# Altium schematic sheet [08] - LoRa_RAK3172.SchDoc
size A4
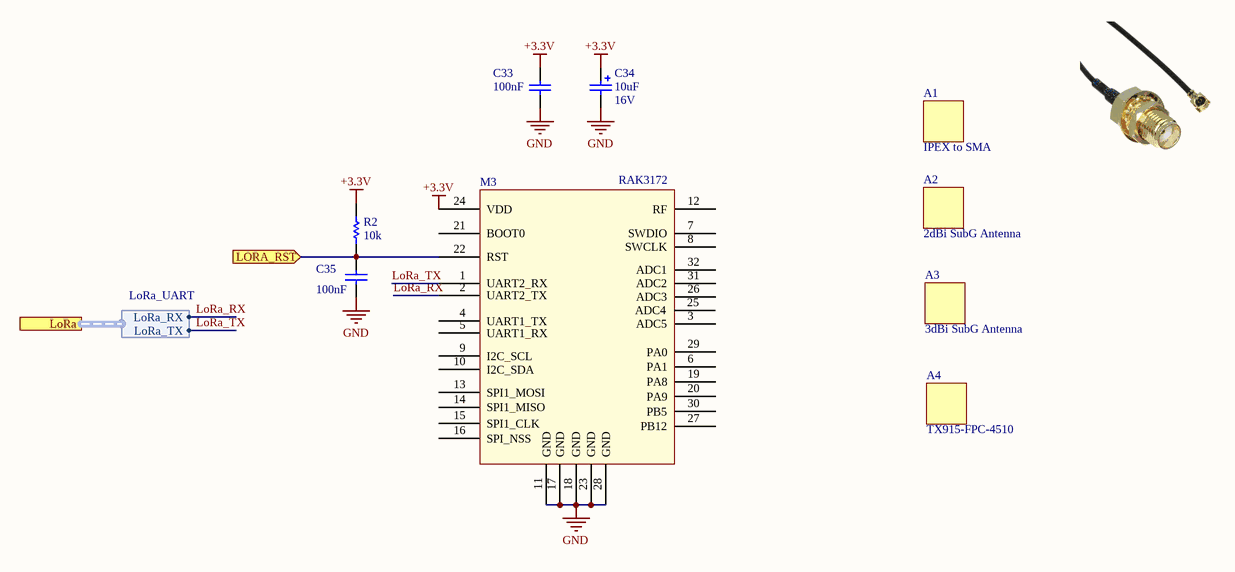
[diagram p0: [08] - LoRa_RAK3172.SchDoc]

## Parts
A1  IPEX to SMA  (mechanical)
A2  2dBi SubG Antenna  (mechanical)
A3  3dBi SubG Antenna  (mechanical)
A4  TX915-FPC-4510  (mechanical)
C33  Capacitance: 100nF  [0603_C]  (hidden comment: Capacitor)
C34  Capacitance: 10uF  Voltage Rating: 16V  [Tantalum 3216 A]  (hidden comment: Capacitor Polarized)
C35  Capacitance: 100nF  [0603_C]  (hidden comment: Capacitor)
M3  RAK3172  [RAK3172]
R2  Resistance: 10k  [Res-0603]  (hidden comment: Res1)

## Ports
LoRa (harness LoRa_UART), LORA_RST (in)

## Harnesses
LoRa_UART: LoRa_RX, LoRa_TX

## Nets
+3.3V: C33.2 C34.1 M3.24(VDD) R2.2
GND: C33.1 C34.2 C35.1 M3.11(GND) M3.17(GND) M3.18(GND) M3.23(GND) M3.28(GND)
LORA_RST: C35.2 M3.22(RST) R2.1 ; port LORA_RST
LoRa_RX: M3.2(UART2_TX) ; port LoRa.LoRa_RX
LoRa_TX: M3.1(UART2_RX) ; port LoRa.LoRa_TX

Not connected (* = marked no-connect by the designer): M3 3(ADC5) 4(UART1_TX) 5(UART1_RX) 6(PA1) 7(SWDIO) 8(SWCLK) 9(I2C_SCL) 10(I2C_SDA) 12(RF) 13(SPI1_MOSI) 14(SPI1_MISO) 15(SPI1_CLK) 16(SPI_NSS) 19(PA8) 20(PA9) 21(BOOT0) 25(ADC4) 26(ADC3) 27(PB12) 29(PA0) 30(PB5) 31(ADC2) 32(ADC1)

## Notes on the sheet
- Title
- Size:
- Date:
- A4
- Number:
- Time:
- Revision:
- Sheet
- of
- File:

## Library data of the parts
A1 = Mechanical_component: IPEX to SMA adapter cable; Manufacturer 1: Adam Equipment; Manufacturer Part Number 1: CA-DKCA0-305L0-AJI0-O; Supplier 1: Digi-Key; Supplier Part Number 1: 2057-CA-DKCA0-305L0-AJI0-O-ND; RoHS: No
A2 = Mechanical_component: Manufacturer 1: 5; Manufacturer Part Number 1: 2dBi SubG Antenna; Supplier Unit Price 1: *
A3 = Mechanical_component: Manufacturer 1: RAK; Manufacturer Part Number 1: 3dBi SubG Antenna; Supplier Unit Price 1: 7
A4 = Mechanical_component: TX915-FPC-4510 868~930MHz adhesive antenna; Manufacturer 1: EBYTE; Manufacturer Part Number 1: TX915-FPC-4510; Supplier Unit Price 1: 0,28
C33 C35 = 1: Cap Ceramic 0.1uF 50VDC X7R 10% SMD 0603 Paper T/R; Manufacturer: Samsung; Manufacturer Part Number: CL10B104KB8NNNC; Voltage Rating: 50V; ComponentLink1URL: http://www.kemet.com/docfinder?Partnumber=C0603C104K5RACTU; ComponentLink1Description: http://www.kemet.com/docfinder?Partnumber=C0603C104K5RACTU; ComponentLink2URL: https://datasheet.ciiva.com/25803/cl10b104kb8nnnc-25803393.pdf?src-supplier=Digi-Key; ComponentLink2Description: https://datasheet.ciiva.com/25803/cl10b104kb8nnnc-25803393.pdf?src-supplier=Digi-Key; ComponentLink3URL: https://datasheet.ciiva.com/26838/getdatasheetpartid-89097-26838411.pdf?src-supplier=Verical; ComponentLink3Description: https://datasheet.ciiva.com/26838/getdatasheetpartid-89097-26838411.pdf?src-supplier=Verical; ComponentLink4URL: https://datasheet.ciiva.com/29198/456651-da-01-en-vs-kondensator-0605-29198839.pdf?src-supplier=Conrad; ComponentLink4Description: https://datasheet.ciiva.com/29198/456651-da-01-en-vs-kondensator-0605-29198839.pdf?src-supplier=Conrad; Supplier 1: Digi-Key; Supplier Part Number 1: 1276-1000-1-ND; RoHS: Yes; Category: Ceramic Capacitors; Stock 1: 17279119; Pricing 1: 1=0,10000, 10=0,03200, 50=0,01720, 100=0,01410, 500=0,01008, 1000=0,00793 (USD); Mount: Surface Mount; Case/Package: 0603; Case Code (Metric): 1608; Case Code (Imperial): 0603; Material: Ceramic; Contact Plating: Tin; Min Operating Temperature: -55°C; Max Operating Temperature: 125°C; Tolerance: 10%; Package Quantity: 1; Packaging: Tape and Reel; Dielectric: X7R; Voltage: 50V; Voltage Rating (DC): 50V; Length: 1.6mm; Height: 0.8mm; Width: 0.031inch; Depth: 0.8mm; Thickness: 0.035inch; Radiation Hardening: No; Lead Free: Lead Free
C34 = 2: CAP TANT 10UF 10% 16V 1206; Manufacturer: Vishay Sprague; Manufacturer Part Number: 293D106X9016A2TE3; Dielectric Material: Tantalum; ESR (Equivalent Series Resistance): 3R; Ripple Current: 160mA; Leakage Current: 1.6uA; Polarity: Polar; Dissipation Factor: 6%; Q Factor: 6; Supplier 1: Digi-Key; Supplier Part Number 1: 718-1123-1-ND; RoHS: Yes; Category: Tantalum Capacitors; Stock 1: 76138; Pricing 1: 1=0,54000, 10=0,38000, 50=0,28720, 100=0,25010, 500=0,18524, 1000=0,15745 (USD); Mount: Surface Mount,PCB; Case/Package: 1206; Case Code (Imperial): 1206; Case Code (Metric): 3216; Min Operating Temperature: -55°C; Max Operating Temperature: 125°C; Tolerance: 10%; Packaging: Tape and Reel; Package Quantity: 1; Voltage Rating (DC): 16V; Termination: SMD/SMT; Voltage: 16V; Features: General Purpose; Series: TANTAMOUNT® 293D; Length: 3.2mm; Width: 1.6mm; Height: 1.6mm; Height - Seated (Max): 0.071inch; Depth: 1.6mm; Radiation Hardening: No; REACH SVHC: Unknown; Lead Free: Lead Free; RoHS Compliant: Yes; ComponentLink1URL: https://datasheet.ciiva.com/11793/0900766b80d97b37-11793412.pdf?src-supplier=RSComponents; ComponentLink1Description: https://datasheet.ciiva.com/11793/0900766b80d97b37-11793412.pdf?src-supplier=RSComponents; ComponentLink2URL: https://datasheet.ciiva.com/257/293d-257982.pdf?src-supplier=Digi-Key; ComponentLink2Description: https://datasheet.ciiva.com/257/293d-257982.pdf?src-supplier=Digi-Key; ComponentLink3URL: https://datasheet.ciiva.com/257/293d-257983.pdf?src-supplier=Digi-Key; ComponentLink3Description: https://datasheet.ciiva.com/257/293d-257983.pdf?src-supplier=Digi-Key; ComponentLink4URL: https://datasheet.ciiva.com/1463/293d-1463155.pdf?src-supplier=Element14; ComponentLink4Description: https://datasheet.ciiva.com/1463/293d-1463155.pdf?src-supplier=Element14; ComponentLink5URL: https://datasheet.ciiva.com/3003/293d-3003829.pdf?src-supplier=Avnet; ComponentLink5Description: https://datasheet.ciiva.com/3003/293d-3003829.pdf?src-supplier=Avnet; ComponentLink6URL: https://datasheet.ciiva.com/16308/293d-16308277.pdf?src-supplier=Future+Electronics; ComponentLink6Description: https://datasheet.ciiva.com/16308/293d-16308277.pdf?src-supplier=Future+Electronics; ComponentLink7URL: https://datasheet.ciiva.com/22695/1910915-22695111.pdf?src-supplier=Element14; ComponentLink7Description: https://datasheet.ciiva.com/22695/1910915-22695111.pdf?src-supplier=Element14; ComponentLink8URL: https://datasheet.ciiva.com/257/293d-257981.pdf?src-supplier=Digi-Key; ComponentLink8Description: https://datasheet.ciiva.com/257/293d-257981.pdf?src-supplier=Digi-Key
M3 = LoRa RAK3172
R2 = 1: Chip Resistor; Manufacturer: Panasonic; Manufacturer Part Number: ERJ-3GEYJ103V; Tolerance: 5%; Power Rating: 100mW; Voltage Rating: 75V; Temperature Coefficient: 200ppm/°C; Voltage Rating (DC): 50V; Supplier 1: Digi-Key; Supplier Part Number 1: P10KGDKR-ND; Stock 1: 10740434; Pricing 1: 1=0.1, 10=0.054, 100=0.022, 1000=0.00988, 2500=0.00858 (USD); Mount: Surface Mount; Case/Package: 0603; Weight: 7.1E-05oz; Case Code (Imperial): 0603; Case Code (Metric): 1608; Contact Plating: Tin; Min Operating Temperature: -55°C; Max Operating Temperature: 155°C; Packaging: Tape and Reel; Package Quantity: 1; Composition: Thick Film; Termination: SMD/SMT; Number of Terminations: 2; Military Standard: Not; Max Power Dissipation: 100mW; Working Voltage: 75V; Features: Automotive AEC-Q200; Length: 1.6mm; Height: 0.45mm; Width: 0.8mm; Depth: 0.8mm; REACH SVHC: No SVHC; Lead Free: Lead Free; ComponentLink1URL: https://datasheet.ciiva.com/34303/2007265-34303757.pdf; ComponentLink1Description: https://datasheet.ciiva.com/34303/2007265-34303757.pdf; ComponentLink2URL: https://datasheet.ciiva.com/11809/0900766b80f806dd-11809566.pdf; ComponentLink2Description: https://datasheet.ciiva.com/11809/0900766b80f806dd-11809566.pdf; ComponentLink3URL: https://datasheet.ciiva.com/28514/1678796-28514213.pdf; ComponentLink3Description: https://datasheet.ciiva.com/28514/1678796-28514213.pdf; ComponentLink4URL: https://datasheet.ciiva.com/30147/4aoa0000ce1-30147029.pdf; ComponentLink4Description: https://datasheet.ciiva.com/30147/4aoa0000ce1-30147029.pdf; ComponentLink5URL: https://datasheet.ciiva.com/46371/1678796-46371909.pdf; ComponentLink5Description: https://datasheet.ciiva.com/46371/1678796-46371909.pdf; ComponentLink6URL: https://datasheet.ciiva.com/24133/aoa0000ce1-37422-24133064.pdf; ComponentLink6Description: https://datasheet.ciiva.com/24133/aoa0000ce1-37422-24133064.pdf; ComponentLink7URL: https://datasheet.ciiva.com/46385/1678796-46385240.pdf; ComponentLink7Description: https://datasheet.ciiva.com/46385/1678796-46385240.pdf; ComponentLink8URL: https://datasheet.ciiva.com/17212/aoa0000ce1-17212106.pdf; ComponentLink8Description: https://datasheet.ciiva.com/17212/aoa0000ce1-17212106.pdf; ComponentLink9URL: https://datasheet.ciiva.com/9117/aoa0000ce1-9117038.pdf; ComponentLink9Description: https://datasheet.ciiva.com/9117/aoa0000ce1-9117038.pdf; ComponentLink10URL: https://datasheet.ciiva.com/16740/aoa0000ce1-16740655.pdf; ComponentLink10Description: https://datasheet.ciiva.com/16740/aoa0000ce1-16740655.pdf; ComponentLink11URL: https://datasheet.ciiva.com/48531/aoa0000ce1-48531887.pdf; ComponentLink11Description: https://datasheet.ciiva.com/48531/aoa0000ce1-48531887.pdf